# EAGLE board CMOSArray (EAGLE 9.3.2)
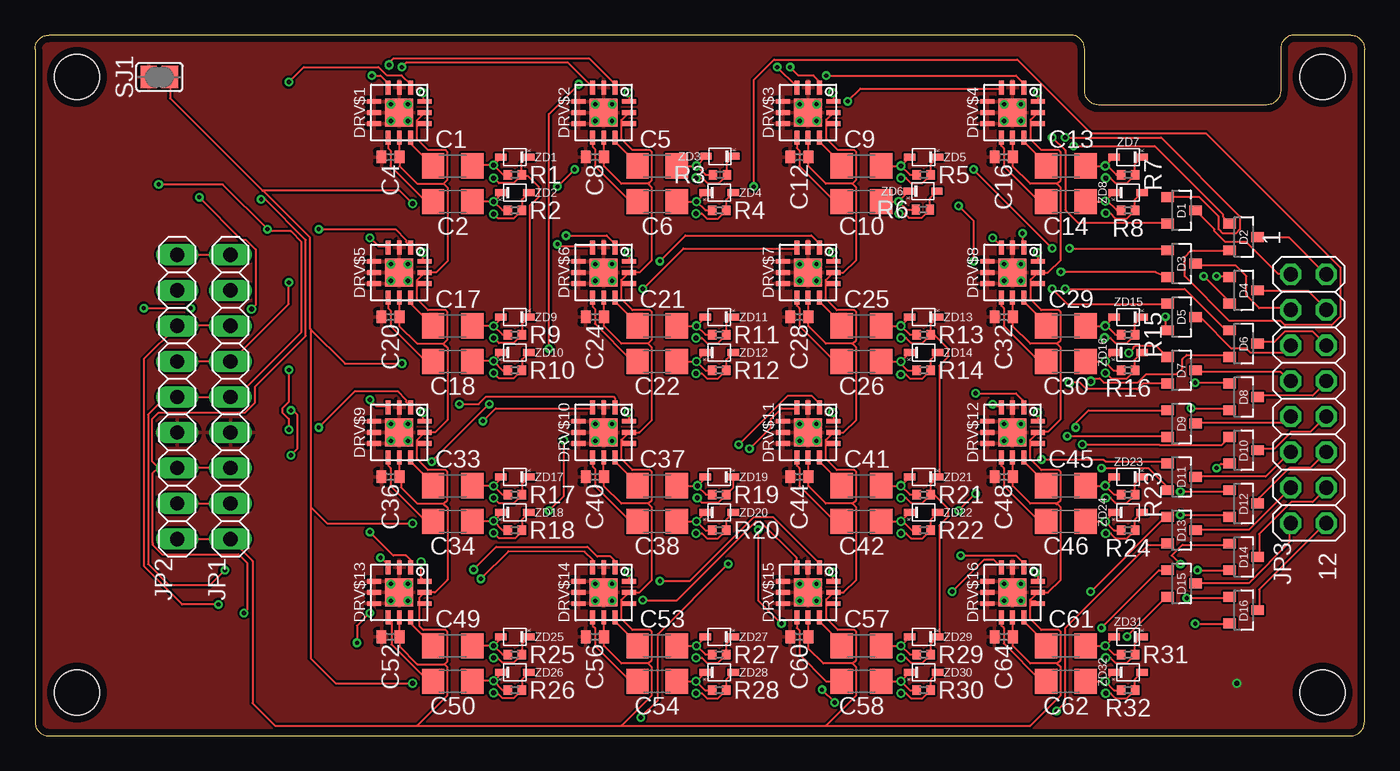
[diagram p3: board, top side]
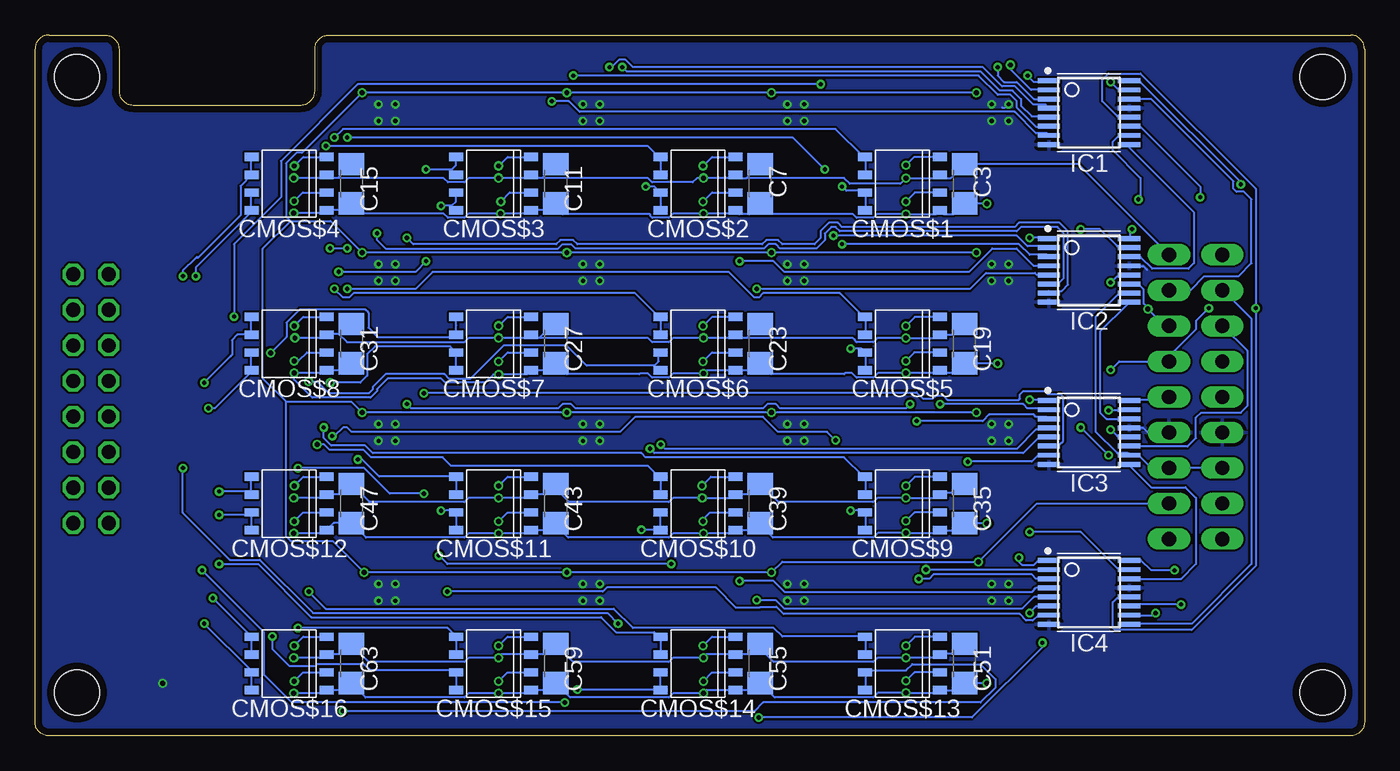
[diagram p4: board, bottom side, seen from below]

Size 95 x 50.09 mm. Coordinates in mm from the lower left corner, seen from the top.
Outline: 1,0 94,0 arc90 95,1 95,49.09 arc90 94,50.09 90,50.09 arc90 89,49.09 89,46.09 arc-90 88,45.09 76,45.09 arc-90 75,46.09 75,49.09 arc90 74,50.09 1,50.09 arc90 0,49.09 0,1 arc90 1,0
Copper layers (1*16): Top 0.035mm / dielectric 1.6mm / Bottom 0.035mm
Design rules "Elecrow_2-layer_PCB_eagle_rule": minimum track width 6mil, minimum drill 12mil, track to track 6mil, track to pad 6mil, pad to pad 6mil, via to via 8mil, smd to smd 0mil, copper to edge 20mil, drill to drill 10mil, minimum pad ring 6mil, minimum via ring 6mil, stop-mask expansion 0mil, vias tented up to drill 100mil, thermal gap 10mil
Holes 3.2 mm at 3,3.1 92,3.1 3,47.09 92,47.09

## Footprints (pad centres in the part's own frame; a part is rotated, then mirrored left to right if it is on the bottom)
C3216 = smd 1.6 x 1.8: 1 -1.4,0; 2 1.4,0
C0402 = smd 0.7 x 0.9: 1 -0.65,0; 2 0.65,0
SOIC-08LG = smd 0.6 x 1: 1 -1.905,-2.675; 2 -0.635,-2.675; 3 0.635,-2.675; 4 1.905,-2.675; 5 1.905,2.675; 6 0.635,2.675; 7 -0.635,2.675; 8 -1.905,2.675
SOT23 = smd 0.7 x 0.9: 1 -0.95,-1; 2 0.95,-1; 3 0,1
QFN12 = smd 1 x 0.35: 1 -1.8,0.8; 2 -1.8,0; 3 -1.8,-0.8; 7 1.8,-0.8; 8 1.8,0; 9 1.8,0.8 | smd 0.35 x 1: 4 -0.8,-1.8; 5 0,-1.8; 6 0.8,-1.8; 10 0.8,1.8; 11 0,1.8; 12 -0.8,1.8 | smd 2 x 2: THP 0,0 | drill 0.305 pad 0.61: THV$1 -0.6,0.6; THV$2 0.6,0.6; THV$3 -0.6,-0.6; THV$4 0.6,-0.6
TTSOP16 = smd 1.6 x 0.35: 1 -2.872,2.275; 2 -2.872,1.625; 3 -2.872,0.975; 4 -2.872,0.325; 5 -2.872,-0.325; 6 -2.872,-0.975; 7 -2.872,-1.625; 8 -2.872,-2.275; 9 2.872,-2.275; 10 2.872,-1.625; 11 2.872,-0.975; 12 2.872,-0.325; 13 2.872,0.325; 14 2.872,0.975; 15 2.872,1.625; 16 2.872,2.275
1X09 = drill 1.016 long: 1 -10.16,0; 2 -7.62,0; 3 -5.08,0; 4 -2.54,0; 5 0,0; 6 2.54,0; 7 5.08,0; 8 7.62,0; 9 10.16,0
2X08 = drill 1.016 octagon: 1 -8.89,-1.27; 2 -8.89,1.27; 3 -6.35,-1.27; 4 -6.35,1.27; 5 -3.81,-1.27; 6 -3.81,1.27; 7 -1.27,-1.27; 8 -1.27,1.27; 9 1.27,-1.27; 10 1.27,1.27; 11 3.81,-1.27; 12 3.81,1.27; 13 6.35,-1.27; 14 6.35,1.27; 15 8.89,-1.27; 16 8.89,1.27
R0402 = smd 0.6 x 0.7: 1 -0.5,0; 2 0.5,0
SJ = smd 1.168 x 1.6: 1 -0.762,0; 2 0.762,0
SOD523 = smd 0.5 x 0.8: P$1 0,1; P$2 0,-1

## Placement (x,y rotation side)
C1  103  [C3216]  29.84,40.73 0 top
C2  103  [C3216]  29.84,38.2 0 top
C3  103  [C3216]  28.57,39.46 270 bottom
C4  474  [C0402]  25.4,41.37 180 top
C5  103  [C3216]  44.45,40.73 0 top
C6  103  [C3216]  44.45,38.2 0 top
C7  103  [C3216]  43.18,39.46 270 bottom
C8  474  [C0402]  40.01,41.37 180 top
C9  103  [C3216]  59.05,40.73 0 top
C10  103  [C3216]  59.05,38.2 0 top
C11  103  [C3216]  57.78,39.46 270 bottom
C12  474  [C0402]  54.61,41.37 180 top
C13  103  [C3216]  73.66,40.73 0 top
C14  103  [C3216]  73.66,38.2 0 top
C15  103  [C3216]  72.39,39.46 270 bottom
C16  474  [C0402]  69.22,41.37 180 top
C17  103  [C3216]  29.84,29.3 0 top
C18  103  [C3216]  29.84,26.77 0 top
C19  103  [C3216]  28.57,28.04 270 bottom
C20  474  [C0402]  25.4,29.94 180 top
C21  103  [C3216]  44.45,29.3 0 top
C22  103  [C3216]  44.45,26.77 0 top
C23  103  [C3216]  43.18,28.04 270 bottom
C24  474  [C0402]  40.01,29.94 180 top
C25  103  [C3216]  59.05,29.3 0 top
C26  103  [C3216]  59.05,26.77 0 top
C27  103  [C3216]  57.78,28.04 270 bottom
C28  474  [C0402]  54.61,29.94 180 top
C29  103  [C3216]  73.66,29.3 0 top
C30  103  [C3216]  73.66,26.77 0 top
C31  103  [C3216]  72.39,28.04 270 bottom
C32  474  [C0402]  69.22,29.94 180 top
C33  103  [C3216]  29.84,17.88 0 top
C34  103  [C3216]  29.84,15.34 0 top
C35  103  [C3216]  28.57,16.61 270 bottom
C36  474  [C0402]  25.4,18.51 180 top
C37  103  [C3216]  44.45,17.88 0 top
C38  103  [C3216]  44.45,15.34 0 top
C39  103  [C3216]  43.18,16.61 270 bottom
C40  474  [C0402]  40.01,18.51 180 top
C41  103  [C3216]  59.05,17.88 0 top
C42  103  [C3216]  59.05,15.34 0 top
C43  103  [C3216]  57.78,16.61 270 bottom
C44  474  [C0402]  54.61,18.51 180 top
C45  103  [C3216]  73.66,17.88 0 top
C46  103  [C3216]  73.66,15.34 0 top
C47  103  [C3216]  72.39,16.61 270 bottom
C48  474  [C0402]  69.22,18.51 180 top
C49  103  [C3216]  29.84,6.44 0 top
C50  103  [C3216]  29.84,3.91 0 top
C51  103  [C3216]  28.57,5.17 270 bottom
C52  474  [C0402]  25.4,7.08 180 top
C53  103  [C3216]  44.45,6.44 0 top
C54  103  [C3216]  44.45,3.91 0 top
C55  103  [C3216]  43.18,5.17 270 bottom
C56  474  [C0402]  40.01,7.08 180 top
C57  103  [C3216]  59.05,6.44 0 top
C58  103  [C3216]  59.05,3.91 0 top
C59  103  [C3216]  57.78,5.17 270 bottom
C60  474  [C0402]  54.61,7.08 180 top
C61  103  [C3216]  73.66,6.44 0 top
C62  103  [C3216]  73.66,3.91 0 top
C63  103  [C3216]  72.39,5.17 270 bottom
C64  474  [C0402]  69.22,7.08 180 top
CMOS$1  TC1550TG  [SOIC-08LG]  33.02,39.46 90 bottom
CMOS$2  TC1550TG  [SOIC-08LG]  47.62,39.46 90 bottom
CMOS$3  TC1550TG  [SOIC-08LG]  62.23,39.46 90 bottom
CMOS$4  TC1550TG  [SOIC-08LG]  76.83,39.46 90 bottom
CMOS$5  TC1550TG  [SOIC-08LG]  33.02,28.04 90 bottom
CMOS$6  TC1550TG  [SOIC-08LG]  47.62,28.04 90 bottom
CMOS$7  TC1550TG  [SOIC-08LG]  62.23,28.04 90 bottom
CMOS$8  TC1550TG  [SOIC-08LG]  76.83,28.04 90 bottom
CMOS$9  TC1550TG  [SOIC-08LG]  33.02,16.61 90 bottom
CMOS$10  TC1550TG  [SOIC-08LG]  47.62,16.61 90 bottom
CMOS$11  TC1550TG  [SOIC-08LG]  62.23,16.61 90 bottom
CMOS$12  TC1550TG  [SOIC-08LG]  76.83,16.61 90 bottom
CMOS$13  TC1550TG  [SOIC-08LG]  33.02,5.17 90 bottom
CMOS$14  TC1550TG  [SOIC-08LG]  47.62,5.17 90 bottom
CMOS$15  TC1550TG  [SOIC-08LG]  62.23,5.17 90 bottom
CMOS$16  TC1550TG  [SOIC-08LG]  76.83,5.17 90 bottom
D1  GSD2004S  [SOT23]  81.92,37.56 270 top
D2  GSD2004S  [SOT23]  86.36,35.66 270 top
D3  GSD2004S  [SOT23]  81.92,33.75 270 top
D4  GSD2004S  [SOT23]  86.36,31.84 270 top
D5  GSD2004S  [SOT23]  81.92,29.94 270 top
D6  GSD2004S  [SOT23]  86.36,28.04 270 top
D7  GSD2004S  [SOT23]  81.92,26.13 270 top
D8  GSD2004S  [SOT23]  86.36,24.22 270 top
D9  GSD2004S  [SOT23]  81.92,22.32 270 top
D10  GSD2004S  [SOT23]  86.36,20.41 270 top
D11  GSD2004S  [SOT23]  81.92,18.51 270 top
D12  GSD2004S  [SOT23]  86.36,16.61 270 top
D13  GSD2004S  [SOT23]  81.92,14.7 270 top
D14  GSD2004S  [SOT23]  86.36,12.79 270 top
D15  GSD2004S  [SOT23]  81.92,10.89 270 top
D16  GSD2004S  [SOT23]  86.36,8.99 270 top
DRV$1  MD1213K6  [QFN12]  26.04,44.55 270 top
DRV$2  MD1213K6  [QFN12]  40.64,44.55 270 top
DRV$3  MD1213K6  [QFN12]  55.24,44.55 270 top
DRV$4  MD1213K6  [QFN12]  69.85,44.55 270 top
DRV$5  MD1213K6  [QFN12]  26.04,33.12 270 top
DRV$6  MD1213K6  [QFN12]  40.64,33.12 270 top
DRV$7  MD1213K6  [QFN12]  55.24,33.12 270 top
DRV$8  MD1213K6  [QFN12]  69.85,33.12 270 top
DRV$9  MD1213K6  [QFN12]  26.04,21.68 270 top
DRV$10  MD1213K6  [QFN12]  40.64,21.68 270 top
DRV$11  MD1213K6  [QFN12]  55.24,21.68 270 top
DRV$12  MD1213K6  [QFN12]  69.85,21.68 270 top
DRV$13  MD1213K6  [QFN12]  26.04,10.26 270 top
DRV$14  MD1213K6  [QFN12]  40.64,10.26 270 top
DRV$15  MD1213K6  [QFN12]  55.24,10.26 270 top
DRV$16  MD1213K6  [QFN12]  69.85,10.26 270 top
IC1  74595PW  [TTSOP16]  19.68,44.55 0 bottom
IC2  74595PW  [TTSOP16]  19.68,33.27 0 bottom
IC3  74595PW  [TTSOP16]  19.68,21.68 0 bottom
IC4  74595PW  [TTSOP16]  19.68,10.26 0 bottom
JP1  [1X09]  13.97,24.22 270 top
JP2  [1X09]  10.16,24.22 270 top
JP3  [2X08]  91,24.09 270 top
R1  103  [R0402]  34.29,40.1 0 top
R2  103  [R0402]  34.29,37.56 180 top
R3  103  [R0402]  48.95,40.1 0 top
R4  103  [R0402]  48.9,37.56 180 top
R5  103  [R0402]  63.5,40.1 0 top
R6  103  [R0402]  63.45,37.61 180 top
R7  103  [R0402]  78.11,40.1 0 top
R8  103  [R0402]  78.11,37.56 180 top
R9  103  [R0402]  34.29,28.67 0 top
R10  103  [R0402]  34.29,26.13 180 top
R11  103  [R0402]  48.9,28.67 0 top
R12  103  [R0402]  48.9,26.13 180 top
R13  103  [R0402]  63.5,28.67 0 top
R14  103  [R0402]  63.5,26.13 180 top
R15  103  [R0402]  78.11,28.67 0 top
R16  103  [R0402]  78.11,26.13 180 top
R17  103  [R0402]  34.29,17.24 0 top
R18  103  [R0402]  34.29,14.7 180 top
R19  103  [R0402]  48.9,17.24 0 top
R20  103  [R0402]  48.9,14.7 180 top
R21  103  [R0402]  63.5,17.24 0 top
R22  103  [R0402]  63.5,14.7 180 top
R23  103  [R0402]  78.11,17.24 0 top
R24  103  [R0402]  78.11,14.7 180 top
R25  103  [R0402]  34.29,5.81 0 top
R26  103  [R0402]  34.29,3.27 180 top
R27  103  [R0402]  48.9,5.81 0 top
R28  103  [R0402]  48.9,3.27 180 top
R29  103  [R0402]  63.5,5.81 0 top
R30  103  [R0402]  63.5,3.27 180 top
R31  103  [R0402]  78.11,5.81 0 top
R32  103  [R0402]  78.11,3.27 180 top
SJ1  [SJ]  8.89,47.09 0 top
ZD1  MM5Z15V  [SOD523]  34.29,41.37 270 top
ZD2  MM5Z15V  [SOD523]  34.29,38.83 90 top
ZD3  MM5Z15V  [SOD523]  48.95,41.42 270 top
ZD4  MM5Z15V  [SOD523]  48.9,38.83 90 top
ZD5  MM5Z15V  [SOD523]  63.5,41.37 270 top
ZD6  MM5Z15V  [SOD523]  63.45,38.93 90 top
ZD7  MM5Z15V  [SOD523]  78.11,41.37 270 top
ZD8  MM5Z15V  [SOD523]  78.11,38.83 90 top
ZD9  MM5Z15V  [SOD523]  34.29,29.94 270 top
ZD10  MM5Z15V  [SOD523]  34.29,27.4 90 top
ZD11  MM5Z15V  [SOD523]  48.9,29.94 270 top
ZD12  MM5Z15V  [SOD523]  48.9,27.4 90 top
ZD13  MM5Z15V  [SOD523]  63.5,29.94 270 top
ZD14  MM5Z15V  [SOD523]  63.5,27.4 90 top
ZD15  MM5Z15V  [SOD523]  78.11,29.94 270 top
ZD16  MM5Z15V  [SOD523]  78.11,27.4 90 top
ZD17  MM5Z15V  [SOD523]  34.29,18.51 270 top
ZD18  MM5Z15V  [SOD523]  34.29,15.97 90 top
ZD19  MM5Z15V  [SOD523]  48.9,18.51 270 top
ZD20  MM5Z15V  [SOD523]  48.9,15.97 90 top
ZD21  MM5Z15V  [SOD523]  63.5,18.51 270 top
ZD22  MM5Z15V  [SOD523]  63.5,15.97 90 top
ZD23  MM5Z15V  [SOD523]  78.11,18.51 270 top
ZD24  MM5Z15V  [SOD523]  78.11,15.97 90 top
ZD25  MM5Z15V  [SOD523]  34.29,7.08 270 top
ZD26  MM5Z15V  [SOD523]  34.29,4.54 90 top
ZD27  MM5Z15V  [SOD523]  48.9,7.08 270 top
ZD28  MM5Z15V  [SOD523]  48.9,4.54 90 top
ZD29  MM5Z15V  [SOD523]  63.5,7.08 270 top
ZD30  MM5Z15V  [SOD523]  63.5,4.54 90 top
ZD31  MM5Z15V  [SOD523]  78.11,7.08 270 top
ZD32  MM5Z15V  [SOD523]  78.11,4.54 90 top

## Tracks (layer width: path | path; a pad name or v marks a point on that pad's centre or on a via)
+5V  (via drill 0.3)
  Top 0.152: v13.56,11.83 12.5,10.76 9.6,10.76 8.08,12.29 8.08,22.95 9.35,24.22 JP2.5 JP1.5 14.43,24.22 19.05,28.85 19.05,35.3 18.29,36.06 16.76,36.06 v16.61,36.21 13.41,39.41 v8.84,39.41
  Bottom 0.152: v13.56,11.83 15.24,11.83 16,12.59 16.76,12.59 IC4.16 | IC3.16 16.76,24.02 14.17,24.02 JP1.5 | v16.61,36.21 16.76,36.06 16.76,35.6 IC2.16 | v8.84,39.41 8.84,39.57 16,46.73 16.76,46.73 IC1.16
+12V
  Top 0.152: JP2.9 JP1.9 15.54,12.49 15.54,2.33 17.14,0.73 27.29,0.73 | DRV$13.8 26.04,7.09 C52.1 26.05,6.39 27.31,5.12 29.26,5.12 | 27.29,0.73 29.47,2.91 29.47,4.91 29.26,5.12 | 29.26,5.12 29.47,5.34 29.47,7.44 29.34,7.57 27.75,7.57 27.46,7.87 27.46,9.54 | 27.46,9.54 27.46,9.88 DRV$13.11 28.57,10.26 29.47,11.15 29.47,16.33 29.21,16.59 29.21,16.61 | 29.21,16.61 27.3,16.61 26.15,17.76 26.15,18.41 C36.1 26.06,18.54 26.06,19.75 DRV$9.8 | 29.21,16.61 29.21,16.62 29.47,16.88 29.47,18.87 29.34,19 28.08,19 27.3,19.78 27.3,21.05 | 27.3,21.05 27.3,21.15 DRV$9.11 28.57,21.68 29.47,22.58 29.47,27.76 29.21,28.02 29.21,28.04 | DRV$9.10 27.47,20.88 27.3,21.05 | DRV$5.8 26.04,29.95 C20.1 26.04,29.92 26.04,29.3 27.3,28.04 29.21,28.04 | 29.21,28.04 29.21,28.05 29.47,28.31 29.47,30.3 29.34,30.43 28.08,30.43 27.3,31.21 27.3,32.48 | 27.3,32.48 27.3,32.59 DRV$5.11 28.67,33.12 29.47,33.92 29.47,39.19 29.2,39.46 | DRV$5.10 27.47,32.31 27.3,32.48 | DRV$1.8 26.04,41.38 C4.1 26.05,40.72 27.3,39.46 29.2,39.46 | 29.2,39.46 29.47,39.74 29.47,41.73 29.34,41.86 28.08,41.86 27.3,42.64 27.3,43.91 | 27.3,43.91 27.3,44.02 DRV$1.11 | DRV$1.10 27.47,43.74 27.3,43.91 | 43.81,5.17 44.08,4.91 44.08,2.91 41.9,0.73 | 43.81,5.17 41.91,5.17 40.66,6.43 C56.1 40.66,8.44 DRV$14.8 | 27.29,0.73 41.9,0.73 | 43.81,5.17 43.81,5.19 44.08,5.45 44.08,7.44 43.95,7.57 42.69,7.57 41.91,8.35 41.91,9.62 | 41.91,9.62 41.91,9.73 DRV$14.11 43.18,10.26 44.08,11.15 44.08,16.34 43.81,16.61 | DRV$14.10 42.08,9.46 41.91,9.62 | 43.81,16.61 41.91,16.61 40.64,17.88 40.64,18.49 C40.1 40.64,18.52 DRV$10.8 | 43.81,16.61 43.81,16.62 44.08,16.88 44.08,18.87 43.95,19 42.69,19 41.91,19.78 41.91,21.15
  Top 0.152: 41.91,21.15 DRV$10.11 43.18,21.68 44.08,22.58 44.08,27.77 43.81,28.04 | DRV$10.10 42.18,20.88 41.91,21.15 | 43.81,28.04 41.91,28.04 40.66,29.29 C24.1 40.66,31.3 DRV$6.8 | 43.81,28.04 43.81,28.05 44.08,28.31 44.08,30.3 43.95,30.43 42.69,30.43 41.91,31.21 41.91,32.48 | 41.91,32.48 41.91,32.59 DRV$6.11 43.18,33.12 44.08,34.01 44.08,39.2 43.88,39.4 | DRV$6.10 42.08,32.31 41.91,32.48 | 43.88,39.4 43.81,39.46 | 43.81,39.46 | 43.81,39.46 41.91,39.46 40.66,40.72 C8.1 40.66,42.73 DRV$2.8 | 43.81,39.46 43.9,39.55 | 43.9,39.55 44.08,39.73 44.08,41.73 43.95,41.86 42.69,41.86 41.91,42.64 41.91,43.91 | 41.91,43.91 41.91,44.02 DRV$2.11 | DRV$2.10 42.08,43.74 41.91,43.91 | 58.41,5.17 58.68,4.9 58.68,2.91 56.5,0.73 | 58.41,5.17 56.33,5.17 55.24,6.26 55.24,7.06 C60.1 55.24,7.09 DRV$15.8 | 41.9,0.73 56.5,0.73 | 56.55,9.62 56.55,8.38 57.36,7.57 58.55,7.57 58.68,7.44 58.68,5.45 58.41,5.17 | 56.55,9.62 56.55,9.76 DRV$15.11 57.78,10.26 58.68,11.15 58.68,16.33 58.41,16.6 | DRV$15.10 56.71,9.46 56.55,9.62 | 58.41,16.6 58.41,16.61 56.52,16.61 55.26,17.86 C44.1 55.24,18.52 DRV$11.8 | 58.41,16.6 58.41,16.61 58.68,16.88 58.68,18.87 58.55,19 57.29,19 56.52,19.78 56.52,21.05 | 56.52,21.05 56.52,21.15 DRV$11.11 57.78,21.68 58.68,22.58 58.68,27.76 58.41,28.04 | DRV$11.10 56.68,20.88 56.52,21.05 | 58.41,28.04 58.42,28.04 58.68,28.3 58.68,30.3 58.55,30.43 57.29,30.43 56.52,31.21 56.52,32.48 | 58.41,28.04 56.52,28.04 55.26,29.29 C28.1 55.26,31.3 DRV$7.8 | 56.52,32.48 56.52,32.59 DRV$7.11 57.78,33.12 58.68,34.01 58.68,39.19 58.41,39.46 | DRV$7.10 56.68,32.31 56.52,32.48 | 58.41,39.46 56.52,39.46 55.26,40.72 C12.1 55.26,42.73 DRV$3.8
  Top 0.152: 58.41,39.46 58.68,39.74 58.68,41.73 58.55,41.86 57.36,41.86 56.55,42.67 56.55,43.91 | 56.55,43.91 56.55,44.05 DRV$3.11 | DRV$3.10 56.71,43.74 56.55,43.91 | 56.5,0.73 71.11,0.73 73.29,2.91 73.29,4.9 73.03,5.16 73.03,5.17 | 73.03,5.17 71.12,5.17 69.86,6.43 C64.1 69.86,8.44 DRV$16.8 | 73.03,5.17 73.29,5.44 73.29,7.44 73.16,7.57 71.9,7.57 71.12,8.35 71.12,9.62 | 73.04,16.59 73.29,16.34 73.29,11.15 72.39,10.26 DRV$16.11 71.12,9.73 71.12,9.62 | 73.04,16.59 73.03,16.61 | 73.03,16.61 | 73.03,16.61 | 73.03,16.61 71.12,16.61 69.86,17.86 C48.1 69.86,19.87 DRV$12.8 | 73.03,16.61 73.29,16.87 73.29,18.87 73.16,19 71.9,19 71.12,19.78 71.12,21.05 | 71.12,21.05 71.12,21.15 DRV$12.11 71.7,21.74 72.39,21.74 73.29,22.63 73.29,27.77 73.03,28.04 | DRV$12.10 71.28,20.88 71.12,21.05 | DRV$8.8 69.86,31.3 C32.1 69.85,29.92 69.85,29.3 71.12,28.04 73.01,28.04 73.02,28.03 73.03,28.04 | 73.03,28.04 73.29,28.3 73.29,30.3 73.16,30.43 71.9,30.43 71.15,31.18 71.15,32.48 | 71.15,32.48 71.15,32.62 DRV$8.11 72.39,33.12 73.29,34.01 73.29,39.2 73.03,39.46 | DRV$8.10 71.32,32.31 71.15,32.48 | DRV$4.8 69.85,41.38 C16.1 69.85,41.35 69.85,40.73 71.12,39.46 73.01,39.46 73.02,39.46 73.03,39.46 | 73.03,39.46 73.29,39.73 73.29,41.73 73.16,41.86 71.9,41.86 71.15,42.61 71.15,43.91 | 71.15,43.91 71.15,44.05 DRV$4.11 | DRV$4.10 71.32,43.74 71.15,43.91 | DRV$16.10 71.48,9.62 71.12,9.62 | 27.46,9.54 27.74,9.54 DRV$13.10 | 27.43,9.54 27.46,9.54 | 73.04,16.59 73,16.55 73.03,16.61 | 43.9,39.55 43.89,39.57 43.89,39.41 43.88,39.4
AGND  (via drill 0.35)
  Top 0.152: ZD2.P$2 34.79,38.33 R2.1 34.76,37.56 34.18,36.98 33.1,36.98 v32.78,37.29 v32.77,37.28 | ZD10.P$2 34.79,26.9 R10.1 34.76,26.13 34.18,25.55 33.15,25.55 v32.77,25.93 | ZD18.P$2 34.79,15.47 R18.1 34.79,14.62 34.29,14.12 33.15,14.12 v32.77,14.5 | ZD26.P$2 34.79,4.04 R26.1 34.21,2.69 33.4,2.69 33.02,3.07 v32.77,3.07 | v47.24,37.34 47.65,37.34 48,36.98 48.82,36.98 R4.1 49.4,38.33 ZD4.P$2 | v47.24,14.48 47.65,14.48 48,14.12 48.82,14.12 R20.1 49.4,15.47 ZD20.P$2 | v47.24,3.05 47.65,3.05 48,2.69 48.82,2.69 R28.1 49.4,4.04 ZD28.P$2 | v61.87,3.05 62.25,3.05 62.6,2.69 63.42,2.69 R30.1 64,4.04 ZD30.P$2 | v61.87,14.48 62.25,14.48 62.6,14.12 63.42,14.12 R22.1 64,15.47 ZD22.P$2 | v61.86,25.84 62.22,25.84 62.51,25.55 63.42,25.55 R14.1 64,26.9 ZD14.P$2 | v61.73,37.34 62.14,37.34 62.44,37.03 63.37,37.03 R6.1 63.95,38.43 ZD6.P$2 | v76.5,37.35 76.84,37.35 77.21,36.98 78.03,36.98 R8.1 78.61,38.33 ZD8.P$2 | v76.48,25.92 76.53,25.92 76.91,25.55 78.03,25.55 R16.1 78.61,26.9 ZD16.P$2 | v76.5,14.48 76.86,14.48 77.21,14.12 78.03,14.12 R24.1 78.61,15.47 ZD24.P$2 | v76.5,3.05 76.86,3.05 77.21,2.69 78.03,2.69 R32.1 78.61,4.04 ZD32.P$2 | v47.24,25.91 47.65,25.91 48,25.55 48.82,25.55 R12.1 49.4,26.9 ZD12.P$2 | SJ1.2 9.65,45.56 16.26,38.96 16.31,38.96 | v26.98,38.04 26.06,38.96 16.31,38.96 | 19.71,29.05 19.71,16.35 | 19.71,16.35 19.71,5.53 21.49,3.75 v26.98,3.75 | 19.71,16.35 20.88,15.18 v26.98,15.18 | 19.71,29.05 19.66,29.1 19.66,35.6 16.31,38.96 | 19.71,29.05 22.15,26.61 v26.21,26.61
  Bottom 0.152: 43.69,37.56 C7.2 43.96,37.28 | C39.2 43.24,15.14 | 43.24,15.14 43.69,14.7 CMOS$10.1 45.17,14.48 v47.24,14.48 49.4,14.48 49.7,14.17 56.9,14.17 57.86,15.13 | C43.2 57.86,15.13 | 57.86,15.13 58.29,14.7 CMOS$11.1 59.78,14.48 v61.87,14.48 64,14.48 64.31,14.17 71.36,14.17 C47.2 73.66,15.21 CMOS$12.1 74.38,14.48 v76.5,14.48 | C11.2 57.94,37.91 | 57.94,37.91 58.29,37.56 CMOS$3.1 59.78,37.34 v61.73,37.34 64,37.34 64.31,37.03 65.5,37.03 65.81,37.34 71.84,37.34 72.48,37.98 | C15.2 72.48,37.98 | 72.48,37.98 72.89,37.56 CMOS$4.1 74.37,37.35 v76.5,37.35 | C63.2 72.4,3.76 | 72.4,3.76 72.89,3.27 CMOS$16.1 74.38,3.05 v76.5,3.05 | 43.96,37.28 36.54,37.28 36.29,37.03 35.1,37.03 34.85,37.28 v32.77,37.28 30.62,37.28 CMOS$1.1 30.07,37.28 29.36,37.28 C3.2 28.55,38.04 v26.98,38.04 | 43.96,37.28 44.67,37.28 CMOS$2.1 45.17,37.34 v47.24,37.34 49.4,37.34 49.7,37.03 50.9,37.03 51.03,37.16 51.03,37.25 51.05,37.28 57.3,37.28 57.94,37.91 | 43.24,15.14 42.27,14.17 35.1,14.17 34.77,14.5 v32.77,14.5 30.55,14.5 CMOS$9.1 29.08,14.7 C35.2 28.55,15.18 v26.98,15.18 | 72.4,3.76 71.38,2.74 64.31,2.74 64,3.05 v61.87,3.05 59.78,3.05 CMOS$15.1 58.29,3.27 C59.2 56.75,2.74 49.7,2.74 49.4,3.05 v47.24,3.05 47.02,3.27 CMOS$14.1 43.69,3.27 C55.2 42.15,2.74 35.1,2.74 34.77,3.07 v32.77,3.07 30.55,3.07 CMOS$13.1 29.08,3.27 C51.2 28.55,3.75 v26.98,3.75 | v26.21,26.61 28.55,26.61 C19.2 29.23,25.98 30.19,25.98 CMOS$5.1 30.55,25.93 v32.77,25.93 34.77,25.93 35.1,25.6 36.29,25.6 36.62,25.93 37.11,25.93 37.19,25.85 42.4,25.85 C23.2 43.69,26.13 CMOS$6.1 47.02,26.13 v47.24,25.91 49.4,25.91 49.7,25.6 50.9,25.6 51.2,25.91 51.76,25.91 51.82,25.85 57,25.85 C27.2 58.29,26.13 CMOS$7.1 59.85,25.84 v61.86,25.84 62.24,25.84 62.84,25.24 65.68,25.24 65.99,25.55 69.8,25.55 70.56,24.78 70.56,24.63 71.02,24.17 75.19,24.17 76.48,25.47 v76.48,25.92 74.37,25.92 CMOS$8.1 72.89,26.13 C31.2
CH1
  Top 0.152: D1.3 83.06,37.43 84.28,36.21 84.28,36.06 85.04,35.3 86.56,35.3 88.85,33.01 89.61,33.01 JP3.1
CH2
  Top 0.152: D2.3 87.48,35.6 89.61,35.6 92.2,33.01 JP3.2
CH3
  Top 0.152: D3.3 83.06,33.62 85.8,33.62 86.56,32.86 86.56,31.49 87.48,30.57 89.61,30.57 JP3.3
CH4
  Top 0.152: D4.3 87.48,31.79 90.98,31.79 92.2,30.57 JP3.4
CH5
  Top 0.152: D5.3 83.06,29.81 83.36,29.81 85.5,27.68 86.56,27.68 86.87,27.38 89.15,27.38 89.61,27.83 JP3.5
CH6
  Top 0.152: D6.3 87.48,28.14 88.54,28.14 89.31,28.9 91.29,28.9 92.2,27.98 JP3.6
CH7
  Top 0.152: D7.3 83.06,26 89,26 89.61,25.39 JP3.7
CH8
  Top 0.152: D8.3 87.48,24.33 91.29,24.33 92.2,25.24 JP3.8
CH9
  Top 0.152: D9.3 83.06,22.34 89.15,22.34 89.61,22.8 JP3.9
CH10
  Top 0.152: D10.3 87.48,20.52 88.54,20.52 89.76,21.74 91.14,21.74 92.2,22.8 JP3.10
CH11
  Top 0.152: D11.3 83.06,18.54 87.94,18.54 89.61,20.21 JP3.11
CH12
  Top 0.152: D12.3 87.48,16.71 87.48,17.01 89.61,19.14 91.14,19.14 92.2,20.21 JP3.12
CH13
  Top 0.152: D13.3 83.06,14.73 86.72,14.73 89.61,17.62 JP3.13
CH14
  Top 0.152: D14.3 87.48,12.9 87.48,14.42 89.76,16.71 91.29,16.71 92.2,17.62 JP3.14
CH15
  Top 0.152: D15.3 83.06,10.92 86.72,10.92 89.61,13.81 89.61,15.18 JP3.15
CH16
  Top 0.152: D16.3 87.48,9.09 87.48,10.46 92.2,15.18 JP3.16
CLR  (via drill 0.3)
  Top 0.152: JP1.7 JP2.7 | 8.38,13.81 8.38,18.74 8.79,19.14 JP2.7 | v16.15,38.35 16.46,38.35 19.36,35.45 19.36,28.59 15.72,24.95 15.72,23.81 15.02,23.11 8.84,23.11 8.38,22.65 8.38,19.6 8.84,19.14 JP2.7 | 8.38,13.81 8.41,13.84 8.41,14.48 | 8.38,13.81 8.41,13.79 8.41,13.66 9.09,12.97 14.55,12.97 15.16,12.36 15.16,9.01 v14.94,8.78
  Bottom 0.152: JP2.7 JP1.7 15.24,19.14 16.16,20.06 IC3.10 16.92,20.21 17.68,20.21 19.2,21.74 19.2,29.96 17.53,31.64 16.92,31.64 IC2.10 | v14.94,8.78 15.09,8.63 IC4.10 | v16.15,38.35 16,38.5 16,39.87 17.98,41.85 17.98,42.46 17.53,42.92 16.92,42.92 IC1.10
DRV11A  (via drill 0.3)
  Top 0.152: v18.14,46.73 19.2,47.8 24.54,47.8 25.15,47.19 26.21,47.19 26.82,46.58 26.82,46.34 DRV$1.1
  Bottom 0.152: v18.14,46.73 17.68,46.27 16.92,46.27 IC1.15
DRV11B  (via drill 0.3)
  Top 0.152: v24.08,47.19 24.69,47.19 25.23,46.64 DRV$1.3
  Bottom 0.152: v24.08,47.19 23.62,46.73 22.71,46.73 IC1.1
DRV12A  (via drill 0.35)
  Top 0.152: DRV$2.1 41.3,46.42 41.3,46.73 39.62,48.41 25.6,48.41 25.3,48.1 v25.3,47.95
  Bottom 0.152: 22.55,46.27 IC1.2 23.82,46.17 25.3,47.64 v25.3,47.95
DRV12B  (via drill 0.3)
  Top 0.152: v26.21,47.8 26.52,48.1 38.1,48.1 39.78,46.42 DRV$2.3
  Bottom 0.152: v26.21,47.8 26.21,47.19 25.76,46.73 24.84,46.73 23.62,45.51 22.57,45.51 IC1.3
DRV13A  (via drill 0.3)
  Top 0.152: DRV$3.1 56.05,46.77 55.63,47.19 54.56,47.19 v53.95,47.8
  Bottom 0.152: 22.55,44.9 IC1.4 22.8,45.12 23.66,45.12 24.97,46.42 25.91,46.42 27.28,47.8 52.28,47.8 52.81,48.33 53.26,48.33 53.79,47.8 v53.95,47.8
DRV13B  (via drill 0.3)
  Top 0.152: v53.03,47.8 54.41,46.42 DRV$3.3
  Bottom 0.152: v53.03,47.8 52.73,47.49 27.43,47.49 26.06,46.12 25.15,46.12 24.54,45.51 24.54,45.05 23.77,44.29 23.32,44.29 23.25,44.22 IC1.5
DRV14A  (via drill 0.3)
  Top 0.152: v56.54,47.19 70.1,47.19 70.56,46.73 70.56,46.42 DRV$4.1
  Bottom 0.152: v56.54,47.19 27.58,47.19 26.21,45.81 25.3,45.81 24.84,45.36 24.84,44.9 23.47,43.53 22.6,43.53 IC1.6
DRV14B  (via drill 0.3)
  Top 0.152: v58.06,45.36 58.98,46.27 69.04,46.27 DRV$4.3
  Bottom 0.152: v58.06,45.36 56.84,45.36 56.08,44.6 24.99,44.6 23.47,43.07 22.71,43.07 IC1.7
DRV21A  (via drill 0.3)
  Top 0.152: v20.27,36.21 25.76,36.21 26.52,35.45 26.52,35.3 26.82,34.99 DRV$5.1
  Bottom 0.152: v20.27,36.21 18.9,36.21 17.68,34.99 16.92,34.99 IC2.15
DRV21B  (via drill 0.3)
  Top 0.152: v23.93,35.6 24.54,34.99 25.15,34.99 DRV$5.3
  Bottom 0.152: v23.93,35.6 22.71,35.6 IC2.1
DRV22A  (via drill 0.3)
  Top 0.152: v37.95,35.76 40.84,35.76 41.3,35.3 41.3,34.99 DRV$6.1
  Bottom 0.152: v37.95,35.76 24.84,35.76 24.08,34.99 22.71,34.99 IC2.2
DRV22B  (via drill 0.3)
  Top 0.152: v37.34,35.15 37.49,34.99 39.78,34.99 DRV$6.3
  Bottom 0.152: v37.34,35.15 24.69,35.15 23.93,34.38 22.71,34.38 IC2.3
DRV23A  (via drill 0.3)
  Top 0.152: v44.65,33.93 46.48,35.76 55.47,35.76 55.93,35.3 55.93,34.99 DRV$7.1
  Bottom 0.152: v44.65,33.93 42.22,33.93 41.45,33.17 28.27,33.17 26.59,34.84 24.87,34.84 23.62,33.59 IC2.4
DRV23B  (via drill 0.3)
  Top 0.152: v43.43,31.95 46.33,34.84 54.41,34.84 DRV$7.3
  Bottom 0.152: v43.43,31.95 28.19,31.95 27.05,33.09 23.54,33.09 23.39,32.94 IC2.5
DRV24A  (via drill 0.3)
  Top 0.152: v70.56,35.91 70.56,34.99 DRV$8.1
  Bottom 0.152: IC2.6 22.55,32.4 21.79,32.4 21.49,32.71 21.49,35.91 21.95,36.37 24.54,36.37 24.84,36.06 37.5,36.06 37.8,36.37 38.1,36.37 38.56,35.91 38.56,35.45 39.17,34.84 41.76,34.84 42.06,35.15 42.6,35.15 42.9,34.84 56.39,34.84 56.69,35.15 57.3,35.15 57.61,34.84 69.95,34.84 70.56,35.45 v70.56,35.91
DRV24B  (via drill 0.3)
  Top 0.152: v68.43,35.6 69.04,34.99 DRV$8.3
  Bottom 0.152: IC2.7 22.55,31.79 21.64,31.79 21.18,32.25 21.18,36.06 21.79,36.67 24.69,36.67 24.99,36.37 37.34,36.37 37.64,36.67 38.25,36.67 38.86,36.06 38.86,35.58 39.29,35.15 41.6,35.15 41.91,35.45 42.75,35.45 43.05,35.15 56.24,35.15 56.54,35.45 57.45,35.45 57.76,35.15 67.97,35.15 v68.43,35.6
DRV31A  (via drill 0.3)
  Top 0.152: v20.27,22.04 22.86,24.63 25.91,24.63 26.52,24.02 26.52,23.87 26.82,23.56 DRV$9.1 | v18.29,20.06 18.75,20.52 18.75,22.95 18.44,23.26 v18.29,23.26
  Bottom 0.152: v20.27,22.04 v18.29,20.06 | v18.29,23.26 16.92,23.26 IC3.15
DRV31B  (via drill 0.3)
  Top 0.152: v23.93,24.02 24.38,23.56 25.15,23.56 DRV$9.3
  Bottom 0.152: v23.93,24.02 22.71,24.02 IC3.1
DRV32A  (via drill 0.3)
  Top 0.152: DRV$10.1 41.45,23.5 41.45,23.72 41.45,24.13 41.33,24.25 32.24,24.25 31.71,23.72 v30.33,23.72
  Bottom 0.152: v30.33,23.72 24.38,23.72 24.08,23.41 22.71,23.41 IC3.2
DRV32B  (via drill 0.3)
  Top 0.152: v32,22.5 32.92,23.41 39.78,23.41 DRV$10.3
  Bottom 0.152: v32,22.5 27.28,22.5 26.82,22.95 23.62,22.95 23.47,22.8 22.71,22.8 IC3.3
DRV33A  (via drill 0.3)
  Top 0.152: v50.29,20.82 53.8,24.33 55.47,24.33 55.93,23.87 55.93,23.56 DRV$11.1
  Bottom 0.152: v50.29,20.82 49.99,20.52 24.84,20.52 23.47,21.89 22.71,21.89 IC3.4
DRV33B  (via drill 0.3)
  Top 0.152: v51.05,20.52 52.58,22.04 52.58,22.65 53.34,23.41 54.41,23.41 DRV$11.3
  Bottom 0.152: v51.05,20.52 50.75,20.21 24.38,20.21 23.32,21.28 22.71,21.28 IC3.5
DRV34A  (via drill 0.3)
  Top 0.152: v67.21,24.48 70.1,24.48 70.56,24.02 70.56,23.56 DRV$12.1
  Bottom 0.152: v67.21,24.48 67.13,24.55 32,24.55 31.55,24.1 30.86,24.1 30.63,24.33 30.1,24.33 29.79,24.02 24.69,24.02 24.61,24.1 24.61,24.4 24.38,24.63 22.86,24.63 22.63,24.4 21.7,24.4 21.53,24.23 21.53,21.09 21.79,20.82 22.55,20.82 IC3.6
DRV34B  (via drill 0.3)
  Top 0.152: v68.43,23.72 68.58,23.56 69.04,23.56 DRV$12.3 | v28.35,19.6 v32.46,23.72
  Bottom 0.152: v32.46,23.72 32.77,23.41 41.76,23.41 42.06,23.72 42.67,23.72 42.98,23.41 56.39,23.41 56.69,23.72 57.3,23.72 57.61,23.41 68.12,23.41 v68.43,23.72 | v28.35,19.6 23.77,19.6 23.32,20.06 22.71,20.06 IC3.7
DRV41A  (via drill 0.3)
  Top 0.152: v23.93,14.57 25.6,12.9 26.52,12.9 26.82,12.59 26.82,12.13 DRV$13.1
  Bottom 0.152: 24.08,14.57 v23.93,14.57 20.27,14.57 17.68,11.98 16.92,11.98 IC4.15
DRV41B  (via drill 0.3)
  Top 0.152: v24.69,12.74 25.15,12.29 25.15,12.13 DRV$13.3
  Bottom 0.152: v24.69,12.74 24.69,12.44 24.48,12.23 23.62,12.23 23.32,12.53 IC4.1
DRV42A  (via drill 0.35)
  Top 0.152: DRV$14.1 41.44,12.51 41.13,12.82 40.16,12.82 39.47,13.51 32.96,13.51 v31.33,11.88
  Bottom 0.152: 22.55,11.83 IC4.2 v31.33,11.88
DRV42B  (via drill 0.3)
  Top 0.152: v31.85,11.22 33.83,13.2 39.28,13.16 39.84,12.6 DRV$14.3
  Bottom 0.152: v31.85,11.22 v31.84,11.23 31.1,11.23 30.81,11.53 23.77,11.53 23.47,11.23 IC4.3
DRV43A  (via drill 0.3)
  Top 0.152: v44.65,11.07 46.79,11.07 51.36,15.64 52.73,15.64 55.93,12.44 55.93,12.13 DRV$15.1
  Bottom 0.152: v44.65,11.07 42.22,11.07 41.45,10.31 23.75,10.31 23.47,10.58 IC4.4
DRV43B  (via drill 0.3)
  Top 0.152: v43.43,9.7 45.87,9.7 51.51,15.34 51.82,15.34 54.41,12.74 54.41,12.13 DRV$15.3
  Bottom 0.152: v43.43,9.7 42.06,9.7 41.45,9.09 24.47,9.09 23.62,9.93 IC4.5
DRV44A  (via drill 0.3)
  Top 0.152: v66.14,12.9 70.1,12.9 70.56,12.44 70.56,12.13 DRV$16.1 | v49.53,12.29 44.5,7.26 44.5,2.53 v43.28,1.31 | v23.01,6.65 23.01,7.87 v23.93,8.78
  Bottom 0.152: v66.14,12.9 65.53,12.29 v49.53,12.29 | v43.28,1.31 28.04,1.31 23.01,6.34 v23.01,6.65 | v23.93,8.78 23.47,9.24 22.71,9.24 IC4.6
DRV44B  (via drill 0.3)
  Top 0.152: DRV$16.3 68.51,12.59 67.82,12.59 v65.53,10.31
  Bottom 0.152: IC4.7 22.71,8.63 23.32,8.63 23.7,8.25 24.18,8.25 24.64,8.71 41.5,8.71 41.97,9.18 | 41.97,9.18 42.05,9.25 | 41.97,9.18 43.2,9.18 43.21,9.16 44.91,9.16 46.36,10.61 54.13,10.61 54.42,10.32 65.53,10.32 v65.53,10.31
FETOE  (via drill 0.35)
  Top 0.152: v27.74,45.97 27.74,45.44 DRV$1.12 | v42.37,45.97 42.44,45.89 DRV$2.12 | v57,45.97 57.05,45.92 DRV$3.12 | v71.63,45.97 71.65,45.95 DRV$4.12 | DRV$5.12 27.74,34.01 v27.74,34.54 | v42.37,34.54 42.44,34.46 DRV$6.12 | v57,34.54 57.05,34.49 DRV$7.12 | v71.63,34.54 71.65,34.52 DRV$8.12 | DRV$9.12 27.68,22.64 27.68,23.05 v27.74,23.11 | v42.37,23.11 42.44,23.04 DRV$10.12 | v57,23.11 57.05,23.06 DRV$11.12 | v71.63,23.11 71.65,23.08 DRV$12.12 | DRV$13.12 27.58,11.31 v27.58,12.44 | v42.37,11.68 42.44,11.61 DRV$14.12 | v57,11.68 57,11.1 DRV$15.12 | v71.48,11.68 71.65,11.5 DRV$16.12 | JP2.8 JP1.8
  Bottom 0.152: v27.74,45.97 v42.37,45.97 v57,45.97 v71.63,45.97 75.92,41.67 76.32,41.67 77.06,40.93 77.06,37.12 76.73,36.8 | v27.74,34.54 v42.37,34.54 v57,34.54 v71.63,34.54 73.89,36.8 76.73,36.8 | v27.74,23.11 v42.37,23.11 v57,23.11 v71.63,23.11 72.39,23.87 77.06,23.87 | 76.73,36.8 78.72,34.81 78.72,25.55 77.06,23.89 77.06,23.87 | 77.06,23.87 77.06,14.25 76.73,13.92 73.72,13.92 v71.48,11.68 v57,11.68 v42.37,11.68 41.6,12.44 v27.58,12.44 23.42,16.61 JP1.8
GND  (via drill 0.35)
  Top 0.152: 23.47,10 23.41,10.04 | DRV$16.THP DRV$16.THV$4 | DRV$12.THP DRV$12.THV$4 | DRV$10.THV$4 DRV$10.THP DRV$10.THV$3 | DRV$9.THP DRV$9.THV$4 | DRV$7.THV$4 DRV$7.THP DRV$7.THV$3 | DRV$11.THV$4 DRV$11.THP DRV$11.THV$3 | DRV$13.THP DRV$13.THV$4 | DRV$5.THV$4 DRV$5.THP DRV$5.THV$3 | DRV$1.THV$4 DRV$1.THP DRV$1.THV$3 | DRV$6.THV$4 DRV$6.THP DRV$6.THV$3 | DRV$2.THP DRV$2.THV$4 | DRV$15.THP DRV$15.THV$4 | DRV$14.THP DRV$14.THV$3
  Bottom 0.152: JP1.6 15.49,21.68 15.82,22.01 IC3.13 | 25.91,44.9 25.68,44.9 DRV$1.THV$3 | IC2.13 15.82,33.59 15.54,33.32 15.52,33.32
  other vias: 85.88,3.75
  pour Top: 0,0 95,0 95,50.09 0,50.09
  pour Bottom: 0,50.26 94.97,50.26 94.97,0.1 0,0.1
N$1
  Top 0.152: DRV$1.9 26.84,42.34 C1.1
N$2  (via drill 0.35)
  Top 0.152: v32.77,40.79 33.29,41.31 ZD1.P$2 | v32.77,40.79 33.45,40.1 R1.1 | v32.77,40.79 31.3,40.79 C1.2
  Bottom 0.152: v32.77,40.79 32.18,41.37 CMOS$1.4
N$3
  Top 0.152: DRV$1.7 25.23,42.01 25.4,41.84 25.4,40.73 27.94,38.2 C2.1
N$4  (via drill 0.35)
  Top 0.152: v32.77,38.2 33.29,38.72 ZD2.P$1 | v32.77,38.2 33.4,37.56 R2.2 | v32.77,38.2 C2.2
  Bottom 0.152: CMOS$1.2 32.13,38.83 v32.77,38.2
N$5
  Top 0.152: DRV$2.9 41.44,42.48 43.05,40.87 C5.1
N$6  (via drill 0.3)
  Top 0.152: v73.61,42.77 80.47,42.77 86.11,37.13 86.11,36.21 85.8,35.91 84.89,35.91 84.58,36.21 84.58,37.13 83.21,38.5 80.92,38.5 D1.1
  Bottom 0.152: v73.61,42.77 73,43.38 37.8,43.38 35.81,41.39 CMOS$1.5 35.66,41.24 35.66,40.18 CMOS$1.6
N$7  (via drill 0.3)
  Top 0.152: v72.69,42.77 73.61,41.85 73.61,37.59 74.52,36.67 80.77,36.67 D1.2 | v37.34,39.26 v38.56,40.48
  Bottom 0.152: v72.69,42.77 40.84,42.77 v38.56,40.48 | v37.34,39.26 37.03,38.96 35.81,38.96 CMOS$1.7 35.66,38.8 35.66,37.59 CMOS$1.8
N$8  (via drill 0.35)
  Top 0.152: C5.2 v47.26,40.73 | v47.26,40.73 ZD3.P$2 | v47.26,40.73 47.9,40.1 R3.1
  Bottom 0.152: v47.26,40.73 46.62,41.37 CMOS$2.4
N$9
  Top 0.152: DRV$2.7 39.84,42.11 40.01,41.95 40.01,40.73 42.55,38.2 C6.1
N$10  (via drill 0.35)
  Top 0.152: C6.2 v47.26,38.2 | v47.26,38.2 ZD4.P$1 | v47.26,38.2 47.9,37.56 R4.2
  Bottom 0.152: v47.26,38.2 46.62,38.83 CMOS$2.2
N$11  (via drill 0.3)
  Top 0.152: v74.22,42.16 80.01,42.16 84.89,37.28 84.89,37.13 85.34,36.67 D2.1
  Bottom 0.152: v74.22,42.16 51.21,42.16 50.44,41.39 CMOS$2.5 50.29,41.24 50.29,40.18 CMOS$2.6
N$12  (via drill 0.3)
  Top 0.152: v51.36,39.26 51.36,46.88 52.81,48.33 70.18,48.33 75.44,43.07 83.67,43.07 93.27,33.47 93.27,29.96 92.66,29.36 89.31,29.36 89,29.66 85.34,29.66 82.14,32.86 82.14,34.23 82.6,34.69 85.34,34.69 D2.2
  Bottom 0.152: v51.36,39.26 50.75,39.26 50.44,38.96 CMOS$2.7 50.29,38.8 50.29,37.59 CMOS$2.8
N$13
  Top 0.152: DRV$3.9 56.05,42.48 57.66,40.87 C9.1
N$14  (via drill 0.35)
  Top 0.152: C9.2 v61.87,40.73 | v61.87,40.73 ZD5.P$2 | v61.87,40.73 62.5,40.1 R5.1
  Bottom 0.152: v61.87,40.73 61.23,41.37 CMOS$3.4
N$15
  Top 0.152: DRV$3.7 54.45,42.01 54.61,41.84 54.61,40.73 57.15,38.2 C10.1
N$16  (via drill 0.35)
  Top 0.152: C10.2 v61.71,38.2 | v61.71,38.2 ZD6.P$1 | v61.71,38.2 62.3,37.61 R6.2
  Bottom 0.152: v61.71,38.2 61.08,38.83 CMOS$3.2
N$17  (via drill 0.3)
  Top 0.152: v73.91,34.84 80.77,34.84 D3.1 | v67.06,40.48 v72.69,34.84
  Bottom 0.152: v72.69,34.84 v73.91,34.84 | 65.23,40.48 v67.06,40.48 | 65.23,40.48 64.92,40.18 CMOS$3.6 | 65.23,40.48 64.92,40.79 64.92,41.24 CMOS$3.5
N$18  (via drill 0.3)
  Top 0.152: v73.3,33.17 80.06,33.17 D3.2 | v67.06,33.93 67.06,36.82 v65.99,37.89
  Bottom 0.152: v73.3,33.17 67.82,33.17 v67.06,33.93 | 65.23,37.89 v65.99,37.89 | 65.23,37.89 64.92,37.59 CMOS$3.8 | 65.23,37.89 64.92,38.2 64.92,38.8 CMOS$3.7
N$19
  Top 0.152: DRV$4.9 70.65,42.48 72.26,40.87 C13.1
N$20  (via drill 0.35)
  Top 0.152: C13.2 v76.47,40.73 76.55,40.82 | 76.55,40.82 ZD7.P$2 | 76.55,40.82 77.27,40.1 R7.1
  Bottom 0.152: v76.47,40.73 75.83,41.37 CMOS$4.4
N$21
  Top 0.152: C14.1 71.75,38.2 69.22,40.73 69.22,42 69.05,42.17 69.04,42.16 69.04,42.62 DRV$4.7
N$22  (via drill 0.35)
  Top 0.152: C14.2 76.47,38.2 v76.49,38.21 76.56,38.29 | 76.56,38.29 ZD8.P$1 | 76.56,38.29 77.29,37.56 R8.2
  Bottom 0.152: v76.49,38.21 75.87,38.83 CMOS$4.2
N$23  (via drill 0.3)
  Top 0.152: v84.43,32.86 85.34,32.86 D4.1
  Bottom 0.152: v84.43,32.86 84.43,33.24 83.52,34.16 | 83.42,34.25 83.52,34.16 | CMOS$4.5 79.55,41.24 79.55,40.18 CMOS$4.6 80.31,39.3 80.31,37.2 83.36,34.16 83.52,34.16
N$24  (via drill 0.3)
  Top 0.152: v83.52,32.86 85.34,31.03 D4.2
  Bottom 0.152: v83.52,32.86 83.52,33.47 79.55,37.43 CMOS$4.8 79.55,37.59 79.55,38.8 CMOS$4.7
N$25
  Top 0.152: DRV$5.9 26.84,30.91 C17.1
N$26  (via drill 0.35)
  Top 0.152: v32.77,29.3 33.4,28.67 R9.1 | v32.77,29.3 33.29,29.82 ZD9.P$2 | v32.77,29.3 31.25,29.3 C17.2
  Bottom 0.152: CMOS$5.4 32.12,29.94 v32.77,29.3
N$27
  Top 0.152: DRV$5.7 25.23,30.58 25.4,30.41 25.4,29.3 27.94,26.77 C18.1
N$28  (via drill 0.35)
  Top 0.152: v32.77,26.79 33.29,27.31 ZD10.P$1 | v32.77,26.79 33.42,26.13 R10.2 | v32.77,26.79 31.27,26.79 C18.2
  Bottom 0.152: CMOS$5.2 32.17,27.4 32.77,26.81 v32.77,26.79
N$29  (via drill 0.3)
  Top 0.152: v72.69,31.95 73.76,30.88 80.77,30.88 D5.1
  Bottom 0.152: CMOS$5.6 35.66,28.75 35.66,29.81 CMOS$5.5 35.81,29.96 37.49,31.64 42.98,31.64 43.28,31.34 43.59,31.34 45.41,33.17 66.6,33.17 67.82,31.95 v72.69,31.95
N$30  (via drill 0.3)
  Top 0.152: v80.77,29.96 80.77,29.05 D5.2 | v38.86,46.58 36.73,44.44 v36.73,27.68
  Bottom 0.152: v80.77,29.96 80.77,35.15 77.42,38.5 77.42,41.09 71.93,46.58 v38.86,46.58 | v36.73,27.68 35.97,27.68 35.81,27.53 CMOS$5.7 35.66,27.38 35.66,26.15 CMOS$5.8
N$31
  Top 0.152: DRV$6.9 41.44,31.04 43.05,29.43 C21.1
N$32  (via drill 0.35)
  Top 0.152: v47.26,29.3 ZD11.P$2 | v47.26,29.3 47.9,28.67 R11.1 | C21.2 v47.26,29.3
  Bottom 0.152: CMOS$6.4 46.62,29.94 v47.26,29.3
N$33
  Top 0.152: DRV$6.7 39.84,30.68 40.01,30.52 40.01,29.47 42.71,26.77 C22.1
N$34  (via drill 0.35)
  Top 0.152: C22.2 v47.26,26.77 | v47.26,26.77 ZD12.P$1 | v47.26,26.77 47.9,26.13 R12.2
  Bottom 0.152: v47.26,26.77 46.62,27.4 CMOS$6.2
N$35  (via drill 0.3)
  Top 0.152: v73.61,31.95 82.14,31.95 85.04,29.05 85.34,29.05 D6.1
  Bottom 0.152: v73.61,31.95 73,31.34 72.54,31.34 72.24,31.64 52.12,31.64 50.44,29.96 CMOS$6.5 50.29,29.81 50.29,28.75 CMOS$6.6
N$36  (via drill 0.35)
  Top 0.152: D6.2 85.34,27.22 82.3,27.22 81.99,26.92 81.99,26.27 81.57,25.85 79.4,25.85 78.8,25.25 76.37,25.25 76.08,25.55 75.64,25.55 v75.44,25.34
  Bottom 0.152: 50.75,26.46 50.44,26.15 CMOS$6.8 | 50.75,26.46 50.44,26.77 50.44,27.38 CMOS$6.7 | 50.75,26.46 55.59,26.46 57.05,27.93 61.49,27.93 63.87,25.55 65.44,25.55 65.75,25.85 69.95,25.85 70.87,24.94 70.87,24.76 71.14,24.48 73.97,24.48 74.83,25.34 v75.44,25.34
N$37
  Top 0.152: DRV$7.9 56.05,31.04 57.66,29.43 C25.1
N$38  (via drill 0.35)
  Top 0.152: C25.2 v61.87,29.3 | v61.87,29.3 ZD13.P$2 | v61.87,29.3 62.5,28.67 R13.1
  Bottom 0.152: v61.87,29.3 61.23,29.94 CMOS$7.4
N$39
  Top 0.152: DRV$7.7 54.45,30.74 54.61,30.57 54.61,29.3 57.15,26.77 57.15,26.26 | 57.15,26.13 57.15,26.26 | 57.15,26.26 C26.1
N$40  (via drill 0.35)
  Top 0.152: C26.2 61.72,26.77 | 61.72,26.77 v61.87,26.77 ZD14.P$1 | 61.72,26.77 62.36,26.13 R14.2
  Bottom 0.152: v61.87,26.77 61.23,27.4 CMOS$7.2
N$41  (via drill 0.35)
  Top 0.152: D7.1 80.12,27.88 78.61,27.88 78.48,27.74 78.48,27.69 v78.16,27.38
  Bottom 0.152: 64.92,28.75 CMOS$7.6 | CMOS$7.5 64.92,29.81 64.92,29.36 64.91,29.34 CMOS$7.6 | v78.16,27.38 77.03,28.51 77.03,29.54 76.09,30.47 71.4,30.47 71.18,30.24 71.18,29.18 70.52,28.52 65.06,28.52 CMOS$7.6
N$42  (via drill 0.35)
  Top 0.152: 80.77,25.09 D7.2 79.16,25.18 78.77,24.78 75.13,24.78 74.68,25.24 v73.91,25.24
  Bottom 0.152: 64.92,26.15 CMOS$7.8 64.91,27.36 64.92,27.38 CMOS$7.7 65.34,27.83 70.71,27.83 71.26,27.28 71.26,25.74 71.76,25.24 v73.91,25.24
N$43
  Top 0.152: DRV$8.9 70.65,31.04 72.26,29.43 C29.1
N$44  (via drill 0.35)
  Top 0.152: C29.2 v76.47,29.3 76.51,29.35 | 76.51,29.35 ZD15.P$2 | 76.51,29.35 77.19,28.67 R15.1
  Bottom 0.152: v76.47,29.3 75.83,29.94 CMOS$8.4
N$45
  Top 0.152: DRV$8.7 69.05,30.74 69.22,30.57 69.22,29.3 71.75,26.77 C30.1
N$46  (via drill 0.35)
  Top 0.152: C30.2 76.43,26.77 | 76.43,26.77 76.47,26.77 v76.49,26.78 ZD16.P$1 | 76.43,26.77 77.06,26.13 R16.2
  Bottom 0.152: v76.49,26.78 76.18,26.78 75.56,27.4 CMOS$8.2
N$47  (via drill 0.3)
  Top 0.152: v82.91,25.24 85.34,25.24 D8.1
  Bottom 0.152: v82.91,25.24 81,27.15 80.92,27.22 80.92,28.29 80.54,28.67 CMOS$8.6 79.55,28.75 79.55,29.81 CMOS$8.5
N$48  (via drill 0.3)
  Top 0.152: v82.6,23.41 85.34,23.41 D8.2
  Bottom 0.152: v82.6,23.41 82.14,23.41 79.55,26 CMOS$8.8 79.55,26.15 79.55,27.38 CMOS$8.7
N$49
  Top 0.152: DRV$9.9 26.84,19.61 28.45,18 C33.1
N$50  (via drill 0.35)
  Top 0.152: v32.77,17.87 33.29,18.39 ZD17.P$2 | v32.77,17.87 32.77,17.85 33.38,17.24 R17.1 | v32.77,17.87 v32.76,17.88 C33.2
  Bottom 0.152: CMOS$9.4 32.12,18.51 v32.77,17.87
N$51
  Top 0.152: DRV$9.7 25.23,19.31 25.4,19.14 25.4,17.88 27.94,15.34 C34.1
N$52  (via drill 0.35)
  Top 0.152: v32.77,15.36 32.75,15.34 C34.2 | v32.77,15.36 33.42,14.7 R18.2 | v32.77,15.36 33.29,15.88 ZD18.P$1
  Bottom 0.152: CMOS$9.2 32.15,15.97 v32.77,15.36
N$53  (via drill 0.3)
  Top 0.152: v74.37,22.04 74.37,22.34 75.29,23.26 80.77,23.26 D9.1
  Bottom 0.152: CMOS$9.6 35.66,17.32 35.66,18.38 CMOS$9.5 35.81,18.54 37.19,19.91 51.36,19.91 51.66,20.21 70.87,20.21 71.4,20.74 73.83,20.74 74.36,21.28 74.37,21.28 v74.37,22.04
N$54  (via drill 0.3)
  Top 0.152: v73.76,21.43 80.77,21.43 D9.2 | v37.8,21.13 37.8,17.16 v36.73,16.1
  Bottom 0.152: v73.76,21.43 73.61,21.43 73,22.04 72.69,22.04 72.39,21.74 53.19,21.74 52.12,22.8 42.98,22.8 41.91,21.74 38.41,21.74 v37.8,21.13 | v36.73,16.1 35.81,16.1 CMOS$9.7 35.66,15.95 35.66,14.73 CMOS$9.8
N$55
  Top 0.152: DRV$10.9 41.44,19.61 43.05,18 C37.1
N$56  (via drill 0.35)
  Top 0.152: 45.88,17.85 C37.2 v47.35,17.88 | ZD19.P$2 47.9,18.42 v47.35,17.88 | R19.1 47.93,17.24 47.35,17.82 v47.35,17.88
  Bottom 0.152: v47.35,17.88 46.71,18.51 CMOS$10.4
N$57
  Top 0.152: DRV$10.7 39.84,19.25 40.01,19.08 40.01,17.88 42.55,15.34 C38.1
N$58  (via drill 0.35)
  Top 0.152: C38.2 v47.26,15.34 | v47.26,15.34 ZD20.P$1 | v47.26,15.34 47.9,14.7 R20.2
  Bottom 0.152: CMOS$10.2 46.76,15.97 47.26,15.47 v47.26,15.34
N$59  (via drill 0.35)
  Top 0.152: 85.34,21.28 D10.1 84.79,20.79 80.37,20.79 80.34,20.82 v74.83,20.82
  Bottom 0.152: CMOS$10.6 50.29,17.32 50.29,18.38 CMOS$10.5 50.44,18.54 51.21,19.3 65.25,19.3 65.86,19.91 70.99,19.91 71.53,20.44 73.96,20.44 74.34,20.82 v74.83,20.82
N$60  (via drill 0.3)
  Top 0.152: v84.43,19.14 84.73,19.45 85.34,19.45 D10.2 | v53.34,8.02 51.66,9.7 v51.66,14.73
  Bottom 0.152: v84.43,19.14 84.43,15.95 81.08,12.59 78.94,12.59 75.13,8.78 54.1,8.78 v53.34,8.02 | v51.66,14.73 50.44,14.73 CMOS$10.8 50.29,14.73 50.29,15.95 CMOS$10.7
N$61
  Top 0.152: DRV$11.9 56.05,19.61 57.66,18 C41.1
N$62  (via drill 0.35)
  Top 0.152: C41.2 v61.87,17.88 | v61.87,17.88 ZD21.P$2 | v61.87,17.88 62.5,17.24 R21.1
  Bottom 0.152: v61.87,17.88 61.23,18.51 CMOS$11.4
N$63
  Top 0.152: DRV$11.7 54.45,19.31 54.61,19.14 54.61,17.88 57.15,15.34 C42.1
N$64  (via drill 0.35)
  Top 0.152: C42.2 v61.87,15.34 61.95,15.42 | 61.95,15.42 ZD22.P$1 | 61.95,15.42 62.66,14.7 R22.2
  Bottom 0.152: v61.87,15.34 61.23,15.97 CMOS$11.2
N$65  (via drill 0.3)
  Top 0.152: v71.93,19.75 76.35,19.75 76.5,19.6 80.77,19.6 D11.1
  Bottom 0.152: v71.93,19.75 71.63,19.75 70.41,18.54 64.92,18.54 CMOS$11.5 64.92,18.38 64.92,17.32 CMOS$11.6
N$66  (via drill 0.3)
  Top 0.152: v76.2,19.14 79.55,19.14 80.77,17.93 80.77,17.62 D11.2 | v65.99,16.1 v67.21,17.32
  Bottom 0.152: v76.2,19.14 71.48,19.14 69.65,17.32 v67.21,17.32 | v65.99,16.1 64.92,16.1 CMOS$11.7 64.92,15.95 64.92,14.73 CMOS$11.8
N$67
  Top 0.152: DRV$12.9 70.65,19.61 72.26,18 C45.1
N$68  (via drill 0.35)
  Top 0.152: C45.2 v76.47,17.88 | v76.47,17.88 ZD23.P$2 | v76.47,17.88 77.11,17.24 R23.1
  Bottom 0.152: v76.47,17.88 75.83,18.51 CMOS$12.4
N$69
  Top 0.152: 71.62,14.7 C46.1 71.75,15.34 69.22,17.88 69.22,19.14 69.05,19.31 DRV$12.7
N$70  (via drill 0.35)
  Top 0.152: C46.2 v76.47,15.34 | v76.47,15.34 ZD24.P$1 | v76.47,15.34 77.11,14.7 R24.2
  Bottom 0.152: v76.47,15.34 75.83,15.97 CMOS$12.2
N$71  (via drill 0.3)
  Top 0.152: v81.84,17.47 85.34,17.47 D12.1
  Bottom 0.152: v81.84,17.47 79.7,17.47 79.55,17.32 | 79.55,17.32 79.55,18.38 CMOS$12.5 | 79.55,17.32 CMOS$12.6
N$72  (via drill 0.3)
  Top 0.152: v81.84,15.79 85.34,15.79 D12.2
  Bottom 0.152: v81.84,15.79 79.7,15.79 79.55,15.95 | 79.55,15.95 79.55,14.73 CMOS$12.8 | 79.55,15.95 CMOS$12.7
N$73
  Top 0.152: DRV$13.9 26.84,8.05 C49.1
N$74  (via drill 0.35)
  Top 0.152: v32.77,6.44 33.4,5.81 R25.1 | v32.77,6.44 33.29,6.96 ZD25.P$2 | v32.77,6.44 31.25,6.44 C49.2
  Bottom 0.152: CMOS$13.4 32.12,7.08 v32.77,6.44
N$75
  Top 0.152: DRV$13.7 25.47,8.22 25.47,6.54 27.94,4.07 27.94,3.4 | 27.94,3.27 27.94,3.4 | 27.94,3.4 C50.1
N$76  (via drill 0.35)
  Top 0.152: v32.77,3.93 33.42,3.27 R26.2 | v32.77,3.93 33.29,4.45 ZD26.P$1 | v32.77,3.93 31.27,3.93 C50.2
  Bottom 0.152: CMOS$13.2 32.15,4.54 v32.77,3.93
N$77  (via drill 0.3)
  Top 0.152: v75.44,10.31 80.77,15.64 D13.1
  Bottom 0.152: CMOS$13.6 35.66,5.89 35.66,6.95 CMOS$13.5 35.81,7.1 41.6,7.1 42.22,7.71 52.28,7.71 53.65,9.09 74.22,9.09 v75.44,10.31
N$78  (via drill 0.3)
  Top 0.152: v73,1.77 73.61,2.38 73.61,7.71 79.55,13.66 80.77,13.66 D13.2
  Bottom 0.152: v73,1.77 43.59,1.77 42.98,2.38 27.43,2.38 26.36,3.45 26.36,4.06 27.43,5.12 32.31,5.12 32.77,4.67 35.66,4.67 CMOS$13.7 35.66,4.51 35.66,3.3 CMOS$13.8
N$79
  Top 0.152: DRV$14.9 41.44,8.19 43.05,6.58 C53.1
N$80  (via drill 0.35)
  Top 0.152: C53.2 v47.26,6.44 | v47.26,6.44 47.9,5.81 R27.1 | ZD27.P$2 v47.26,6.44
  Bottom 0.152: v47.26,6.44 46.62,7.08 CMOS$14.4
N$81
  Top 0.152: DRV$14.7 39.84,7.88 40.01,7.71 40.01,6.44 42.55,3.91 C54.1
N$82  (via drill 0.35)
  Top 0.152: C54.2 v47.24,3.91 | v47.24,3.91 47.26,3.91 ZD28.P$1 | v47.24,3.91 47.88,3.27 R28.2
  Bottom 0.152: v47.24,3.91 46.61,4.54 CMOS$14.2
N$83  (via drill 0.3)
  Top 0.152: v81.84,12.29 81.23,12.9 81.99,13.66 85.34,13.66 D14.1
  Bottom 0.152: CMOS$14.6 50.29,5.89 50.29,6.95 CMOS$14.5 50.44,7.1 50.75,7.41 53.48,7.41 54.55,8.48 75.26,8.48 79.07,12.29 v81.84,12.29
N$84  (via drill 0.3)
  Top 0.152: v83.06,11.83 85.34,11.83 D14.2 | v56.24,3.3 v57.15,2.38
  Bottom 0.152: v83.06,11.83 78.64,7.41 78.64,4.36 76.66,2.38 v57.15,2.38 | v56.24,3.3 50.44,3.3 CMOS$14.8 50.29,3.3 50.29,4.51 CMOS$14.7
N$85
  Top 0.152: DRV$15.9 56.05,8.19 57.66,6.58 C57.1
N$86  (via drill 0.35)
  Top 0.152: C57.2 v61.87,6.44 | v61.87,6.44 62.5,5.81 R29.1 | ZD29.P$2 v61.87,6.44
  Bottom 0.152: v61.87,6.44 61.23,7.08 CMOS$15.4
N$87
  Top 0.152: DRV$15.7 54.45,7.72 54.61,7.55 54.61,5.81 56.52,3.91 C58.1
N$88  (via drill 0.35)
  Top 0.152: C58.2 v61.87,3.91 | v61.87,3.91 ZD30.P$1 | v61.87,3.91 62.5,3.27 R30.2
  Bottom 0.152: v61.87,3.91 61.23,4.54 CMOS$15.2
N$89  (via drill 0.3)
  Top 0.152: v76.2,7.71 80.31,11.83 80.77,11.83 D15.1
  Bottom 0.152: v76.2,7.71 65.53,7.71 64.92,7.1 CMOS$15.5 64.92,6.95 64.92,5.89 CMOS$15.6
N$90  (via drill 0.3)
  Top 0.152: v78.03,7.1 80.77,9.85 D15.2
  Bottom 0.152: v78.03,7.1 78.03,6.19 76.81,4.97 74.98,4.97 74.83,5.12 71.48,5.12 71.02,4.67 64.92,4.67 CMOS$15.7 64.92,4.51 64.92,3.3 CMOS$15.8
N$91
  Top 0.152: DRV$16.9 70.65,8.19 72.26,6.58 C61.1
N$92  (via drill 0.35)
  Top 0.152: C61.2 v76.47,6.44 | v76.47,6.44 ZD31.P$2 | v76.47,6.44 77.11,5.81 R31.1
  Bottom 0.152: v76.47,6.44 75.83,7.08 CMOS$16.4
N$93
  Top 0.152: DRV$16.7 69.05,7.88 69.22,7.71 69.22,6.61 71.92,3.91 C62.1
N$94  (via drill 0.35)
  Top 0.152: C62.2 v76.47,3.91 | v76.47,3.91 ZD32.P$1 | v76.47,3.91 77.11,3.27 R32.2
  Bottom 0.152: v76.47,3.91 75.83,4.54 CMOS$16.2
N$95  (via drill 0.3)
  Top 0.152: v82.3,9.85 85.34,9.85 D16.1
  Bottom 0.152: v82.3,9.85 79.55,7.1 CMOS$16.5 79.55,6.95 79.55,5.89 CMOS$16.6
N$96  (via drill 0.3)
  Top 0.152: v82.91,8.02 85.34,8.02 D16.2
  Bottom 0.152: v82.91,8.02 79.55,4.67 CMOS$16.7 79.55,4.51 79.55,3.3 CMOS$16.8
QH*$1
  Bottom 0.152: IC1.9 16.81,42.05 12.19,37.43 12.19,33.77 12.57,33.39 15.16,33.39 16,34.23 16.76,34.23 IC2.14
QH*$2
  Bottom 0.152: IC3.14 16.92,22.65 18.44,22.65 18.9,23.11 18.9,28.9 16.92,30.88 IC2.9
QH*$3
  Bottom 0.152: IC4.14 13.11,11.22 12.04,12.29 12.04,17.01 12.8,17.77 15.24,17.77 16.76,19.3 IC3.9
QH*$4
  Bottom 0.152: IC4.9 16.76,8.02 12.34,8.02 8.08,12.29 8.08,29.81 10.06,31.79 JP2.2
RCK  (via drill 0.3)
  Top 0.152: v18.14,26.15 18.14,23.87 17.68,23.41 17.68,23.11 18.14,22.65 v18.14,21.89 | v18.14,32.4 18.14,30.88 14.02,26.77 JP1.4 JP2.4 | v7.77,30.57 v11.12,30.57
  Bottom 0.152: v18.14,21.89 17.68,21.43 16.92,21.43 IC3.12 | v18.14,26.15 17.53,26.77 JP1.4 13.87,26.77 13.87,27.22 12.04,29.05 12.04,29.66 v11.12,30.57 | v18.14,32.4 17.68,32.86 16.92,32.86 IC2.12 | IC4.12 16.92,9.85 17.68,9.85 17.98,9.54 17.98,7.71 17.83,7.56 12.34,7.56 7.77,12.13 v7.77,30.57 7.77,39.11 16,47.34 18.29,47.34 18.75,46.88 18.75,45.36 17.68,44.29 16.92,44.29 IC1.12
SCK  (via drill 0.3, 0.35)
  Top 0.152: v11.73,38.5 14.78,35.45 15.09,35.45 15.77,34.77 15.77,30.8 v15.47,30.5 | v13.11,9.39 10.52,9.39 7.77,12.13 7.77,26.92 JP2.3 10.21,29.36 13.87,29.36 JP1.3
  Bottom 0.152: IC2.11 16.76,32.4 16.71,32.35 16.22,32.35 15.79,31.91 15.79,30.89 15.47,30.57 v15.47,30.5 14.28,29.3 JP1.3 | v11.73,38.5 11.73,39.26 16,43.53 16.76,43.53 IC1.11 | v13.11,9.39 16.76,9.39 IC4.11 | JP2.3 8.38,27.53 8.38,23.56 8.84,23.11 11.67,23.11 12.04,22.74 12.04,21.28 12.65,20.67 16.77,20.67 IC3.11
SER
  Bottom 0.152: JP1.2 12.45,31.84 11.43,32.86 8.99,32.86 8.08,33.77 8.08,38.35 8.61,38.88 9.14,38.88 9.37,39.11 9.37,39.64 15.24,45.51 16.76,45.51 IC1.14
VPP  (via drill 0.35)
  Top 0.152: ZD1.P$1 35.18,41.37 34.75,40.94 34.75,40.14 R1.2 | R1.2 34.79,40.07 34.21,39.49 33.15,39.49 v32.77,39.87 | v32.77,28.44 33.15,28.06 34.18,28.06 R9.2 34.79,29.44 ZD9.P$1 35.36,29.96 35.36,37.89 35.97,38.5 35.97,39.26 35.2,40.02 34.9,40.02 R1.2 | ZD17.P$1 34.79,18.01 R17.2 34.79,17.21 34.21,16.63 33.15,16.63 v32.77,17.01 | ZD25.P$1 34.79,6.58 R25.2 34.21,5.23 33.4,5.23 33.05,5.58 v32.77,5.58 | v47.24,39.88 47.69,39.88 48.04,39.52 48.87,39.52 R3.2 49.45,40.92 ZD3.P$1 | v47.24,28.45 47.65,28.45 48,28.09 48.82,28.09 R11.2 49.4,29.51 49.83,29.94 ZD11.P$1 | ZD19.P$1 49.9,17.74 R19.2 48.82,16.66 47.67,16.66 v47.32,17.01 | v47.24,5.59 47.65,5.59 48,5.23 48.82,5.23 R27.2 49.4,6.58 ZD27.P$1 | v61.87,5.59 62.25,5.59 62.6,5.23 63.42,5.23 R29.2 64,6.58 ZD29.P$1 64.62,7.1 64.62,15.03 65.23,15.64 65.23,16.25 64.01,17.47 R21.2 | v61.87,17.02 62.25,17.02 62.6,16.66 63.42,16.66 R21.2 | R21.2 64,18.01 ZD21.P$1 64.62,18.54 64.62,26.46 65.23,27.07 65.23,27.68 64.01,28.9 R13.2 | v61.87,28.45 62.25,28.45 62.6,28.09 63.42,28.09 R13.2 | R13.2 64,29.44 ZD13.P$1 | v61.87,39.88 62.25,39.88 62.6,39.52 63.42,39.52 R5.2 64,40.87 ZD5.P$1 | v76.5,39.88 76.86,39.88 77.21,39.52 78.03,39.52 R7.2 78.61,40.87 ZD7.P$1 | v76.43,28.45 76.86,28.45 77.21,28.09 78.03,28.09 R15.2 78.61,29.44 ZD15.P$1 | v76.5,17.02 76.86,17.02 77.21,16.66 78.03,16.66 R23.2 78.61,18.01 ZD23.P$1 | v76.5,5.59 76.86,5.59 77.21,5.23 78.03,5.23 R31.2 78.61,6.58 ZD31.P$1 | JP2.1 JP1.1
  Bottom 0.152: C19.1 29.34,28.67 CMOS$5.3 30.57,28.44 v32.77,28.44 34.8,28.44 35.1,28.14 36.29,28.14 36.42,28.27 36.42,28.29 36.58,28.44 44.17,28.44 | C35.1 29.18,17.39 30.19,17.39 CMOS$9.3 30.57,17.01 v32.77,17.01 34.8,17.01 35.1,16.71 41.89,16.71 C39.1 43.95,17.24 CMOS$10.3 45.18,17.01 v47.32,17.01 49.41,17.01 49.7,16.71 56.85,16.71 57.96,17.83 | C51.1 29.26,5.89 30.27,5.89 CMOS$13.3 30.57,5.58 v32.77,5.58 34.8,5.58 35.1,5.28 42.22,5.28 43.35,6.41 | C55.1 43.35,6.41 | 43.35,6.41 43.95,5.81 CMOS$14.3 47.02,5.81 v47.24,5.59 49.4,5.59 49.7,5.28 56.55,5.28 57.81,6.55 | C59.1 57.81,6.55 | 57.81,6.55 58.55,5.81 CMOS$15.3 61.65,5.81 v61.87,5.59 64,5.59 64.31,5.28 71.18,5.28 72.43,6.54 | C43.1 57.96,17.83 | 57.96,17.83 58.55,17.24 CMOS$11.3 59.78,17.02 v61.87,17.02 64,17.02 64.31,16.71 71.1,16.71 C47.1 73.16,17.24 CMOS$12.3 74.38,17.02 v76.5,17.02 | 58.55,40.1 C11.1 58.77,39.88 | v76.5,39.88 74.38,39.88 CMOS$4.3 73.94,39.88 73.38,39.88 | v76.43,28.45 74.38,28.45 CMOS$8.3 74.08,28.75 73.32,28.75 | C63.1 72.43,6.54 | 72.43,6.54 73.16,5.81 CMOS$16.3 74.38,5.59 v76.5,5.59 | 44.17,39.88 37.19,39.88 36.77,39.46 33.17,39.46 v32.77,39.87 30.57,39.87 CMOS$1.3 30.12,39.87 29.57,39.87 C3.1 20.45,40.87 JP1.1 | 58.77,39.88 51.21,39.88 50.9,39.57 48.01,39.57 47.7,39.88 v47.24,39.88 45.17,39.88 CMOS$2.3 44.96,39.88 44.17,39.88 | 73.38,39.88 65.81,39.88 65.5,39.57 64.31,39.57 64,39.88 v61.87,39.88 59.78,39.88 CMOS$3.3 59.33,39.88 58.77,39.88 | C7.1 44.17,39.88 | C15.1 73.38,39.88 | C23.1 44.17,28.44 | 44.17,28.44 44.72,28.44 CMOS$6.3 45.17,28.45 v47.24,28.45 49.4,28.45 49.7,28.14 50.9,28.14 51.2,28.45 51.96,28.45 51.97,28.44 58.98,28.44
  Bottom 0.152: 58.98,28.44 59.33,28.44 CMOS$7.3 59.78,28.45 v61.87,28.45 64,28.45 64.31,28.14 72.71,28.14 73.32,28.75 | C27.1 57.98,29.43 58.98,28.44 | 73.32,28.75 72.77,28.75 72.39,29.13 C31.1

## Text on the board
tPlace: 1 | 12